# Altium schematic sheet digital_voltage_channel.SchDoc: Digital Voltage Channel
size A4; DrawnBy: Stefan Lippuner; Organization: TIK; DocumentNumber: 7; Revision: 1; SheetNumber: 7; SheetTotal: 8
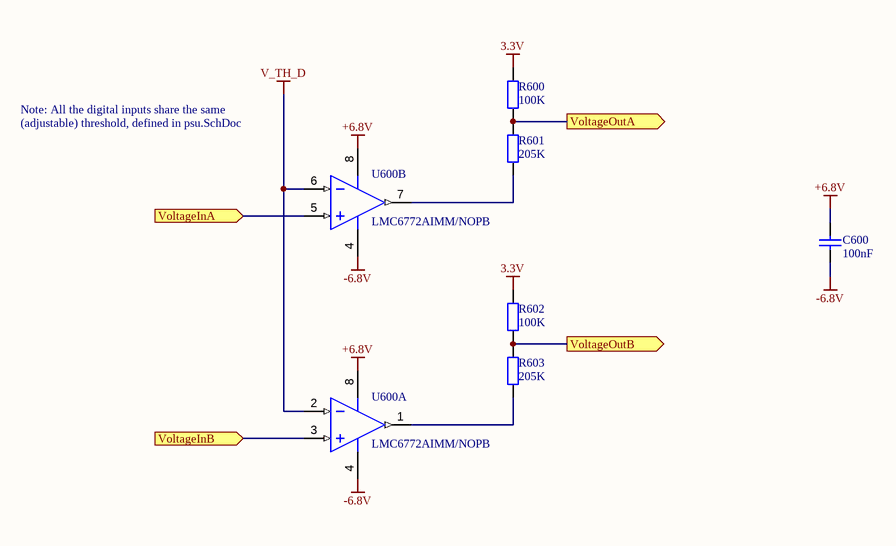
[diagram p0: digital_voltage_channel.SchDoc]

## Parts
C600  100nF  [CAPC0402(1005)60_L]
R600  100K  [RESC0402(1005)_L]
R601  205K  [RESC0402(1005)_L]
R602  100K  [RESC0402(1005)_L]
R603  205K  [RESC0402(1005)_L]
U600  LMC6772AIMM/NOPB  [DGK0008A_L]  (parts A,B of 2)

## Ports
VoltageInA (in), VoltageInB (in), VoltageOutA (out), VoltageOutB (out)

## Nets
3.3V: R600.2 R602.2
+6.8V: C600.2 U600.8(V+)
-6.8V: C600.1 U600.4(V-)
V_TH_D: U600.2(INA-) U600.6(INB-)
VoltageInA: U600.5(INB+) ; port VoltageInA
VoltageInB: U600.3(INA+) ; port VoltageInB
VoltageOutA: R600.1 R601.2 ; port VoltageOutA
VoltageOutB: R602.1 R603.2 ; port VoltageOutB
NetR601_1: R601.1 U600.7(OUTB)
NetR603_1: R603.1 U600.1(OUTA)

## Notes on the sheet
- Note: All the digital inputs share the same (adjustable) threshold, defined in psu.SchDoc
- 1
- 2
- 3
- 4
- A
- B
- C
- Drawing title:
- D
- Date:
- Drawing number:
- Rev:
- Format:
- A4 Q
- Drawn by:
- Laboratory:
- Page
- Project:
- of
- File:

## Library data of the parts
C600 = CMP-1034-02071-1: CAP 100nF 16V -20% to +80% 0402 (1005 Metric) Thickness 0.6mm SMD; Case-Metric: 1005; Case-EIA: 0402; Value: 100nF; Rated Voltage: 16 V; Tolerance: -20% to +80%; Technology: SMT; Max Thickness: 0.6 mm
R600 R602 = CMP-1011-00801-1: 100K 0.063W 1% 0402 (1005 Metric)  SMD; Case-Metric: 1005; Value: 100000.00 Ohm; Case-EIA: 0402; Tolerance: 1 %; Technology: SMT; Power: 0.063 W
R601 R603 = CMP-1011-00769-1: 205K 0.063W 1% 0402 (1005 Metric)  SMD; Case-EIA: 0402; Value: 205000.00 Ohm; Case-Metric: 1005; Technology: SMT; Tolerance: 1 %; Power: 0.063 W
U600 = CMP-0055-01401-3: Dual Micro-Power Rail-to-Rail Input CMOS Comparator with Open Drain Output, 8-pin Mini SOIC, Pb-Free; Manufacturer: Texas Instruments; PowerWise: Y; CompType: Amplifiers; PackageTopMarking: ZXTT*C21; RoHS: Y; DatasheetVersion: Aug-2000; PackageDescription: MINI SOIC, .118 x .118 x .034in, 8 Lead, .0256in Pitch; Code_JEDEC: MO-187-AA; PackageReference: MUA08A; PackageVersion: revF, Apr-2008; PinCount: 8; PartId: 1; ComponentLink1URL: http://www.ti.com/general/docs/lit/getliterature.tsp?genericPartNumber=LMC6772&fileType=pdf; ComponentLink1Description: Datasheet URL; Package Reference: DGK0008A